# Altium project Tuturial.PrjPCB
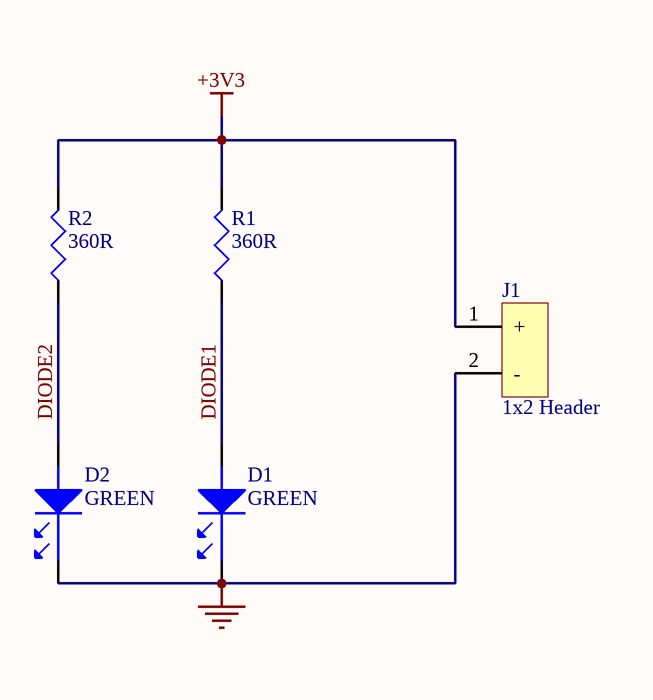
[diagram p0: LED.SchDoc]
1 sheet, 5 parts. Net scope: global (net labels, ports and power ports of the same name join across sheets).
Board file: LED.PcbDoc

## Sheet LED.SchDoc
size A4

### Parts
D1  GREEN  [LED_LNJ626 GREEN]
D2  GREEN  [LED_LNJ626 GREEN]
J1  1x2 Header  [HDR1X2]
R1  360R  [R_CRCW0805]
R2  360R  [R_CRCW0805]

### Nets
+3V3: J1.1(+) R1.2 R2.2
GND: D1.1 D2.1 J1.2(-)
DIODE1: D1.2 R1.1
DIODE2: D2.2 R2.1

### Library data of the parts
D1 D2 = LNJ626W8CRA: PANASONIC - LNJ626W8CRA - LED, REINGRÜN, HIGH-BRIGHTNESS, 0603; Manufacturer: Panasonic SSG; Luminous Intensity: 40mcd; Forward Voltage: 2.9V; Forward Current: 5mA; Wavelength: 527nm; Lens Style: Rectangular; Number of LEDs: 1; Reverse Voltage: 5V; Supplier 1: Digi-Key; Supplier Part Number 1: P13497CT-ND; Manufacturer Part Number: LNJ626W8CRA; Stock 1: 0; Mount: Surface Mount; Case/Package: 0603; Number of Pins: 2; Color: Green; Case Code (Metric): 1608; Case Code (Imperial): 0603; Min Operating Temperature: -30°C; Max Operating Temperature: 85°C; Illumination Color: Green; Packaging: Tape and Reel; Package Quantity: 5000; Test Current: 5mA; Dominant Wavelength: 527nm; Length: 1.6mm; Height: 0.43mm; Width: 0.8mm; REACH SVHC: Yes; Lead Free: Lead Free; ComponentLink1URL: http://www.mouser.com/ds/2/315/LNJ626W8CRA_CEK-226053.pdf?src-supplier=Mouser; ComponentLink1Description: http://www.mouser.com/ds/2/315/LNJ626W8CRA_CEK-226053.pdf?src-supplier=Mouser; ComponentLink2URL: http://www.farnell.com/datasheets/1512070.pdf?src-supplier=Element14; ComponentLink2Description: http://www.farnell.com/datasheets/1512070.pdf?src-supplier=Element14; Category: Optoelectronics
J1 = 22-29-2021: Conn Wire to Board HDR 2 POS 2.54mm Solder ST Thru-Hole Bag; Manufacturer: Molex; Number of Positions: 2; Connector Type: Header,Male Pin; Gender: Male; Voltage Rating (DC): 250V; Contact Post Length: 0.14inch; Glow Wire Compliant: Non-compliant; Supplier 1: Newark; Manufacturer Part Number: 22-29-2021; Stock 1: 0; Mount: Through Hole; Color: White; Contact Plating: Gold; Contact Material: Brass; Contact Shape: Square; Insulation Material: Nylon; Insulation Color: Natural; Max Operating Temperature: 80°C; Number of Rows: 1; Packaging: Bag; Termination: Solder; Fastening Type: Friction; Contact Mating Length: 0.295inch; Insulation Height: 0.461inch; Lead Free: Lead Free; Halogen Free: Low Halogen; Flammability Rating: UL94 V-0; ComponentLink1URL: https://www.molex.com/pdm_docs/sd/022292021_sd.pdf?src-supplier=Digi-Key; ComponentLink1Description: https://www.molex.com/pdm_docs/sd/022292021_sd.pdf?src-supplier=Digi-Key; Supplier Part Number 1: 91C4367; Category: Connectors
R1 R2 = CRCW08053R60FNEA: RES SMD 3.6 OHM 1% 1/8W 0805; Manufacturer: Vishay Dale; Resistance: 3.6R; Max Power Dissipation: 125mW; Temperature Coefficient: 200ppm/°C; Voltage Rating (DC): 150V; Supplier 1: Digi-Key; Supplier Part Number 1: 541-3.60CCT-ND; Manufacturer Part Number: CRCW08053R60FNEA; Stock 1: 0; Case/Package: 0805; Case Code (Metric): 2012; Case Code (Imperial): 0805; Contact Plating: Tin; Min Operating Temperature: -55°C; Max Operating Temperature: 155°C; Packaging: Tape and Reel; Tolerance: 1%; Package Quantity: 5000; Composition: Thick Film; Number of Terminations: 2; Features: Automotive AEC-Q200; Length: 0.079inch; Height: 0.02inch; Width: 0.049inch; Radiation Hardening: No; Lead Free: Lead Free; ComponentLink1URL: http://www.vishay.com/docs/20035/dcrcwe3.pdf?src-supplier=Digi-Key; ComponentLink1Description: http://www.vishay.com/docs/20035/dcrcwe3.pdf?src-supplier=Digi-Key; Category: Resistors

## Assembly variants
LED2 Not Fited: not fitted D2 R2